# Altium schematic sheet COBConnector.SchDoc
size C; SheetNumber: 2; SheetTotal: 3
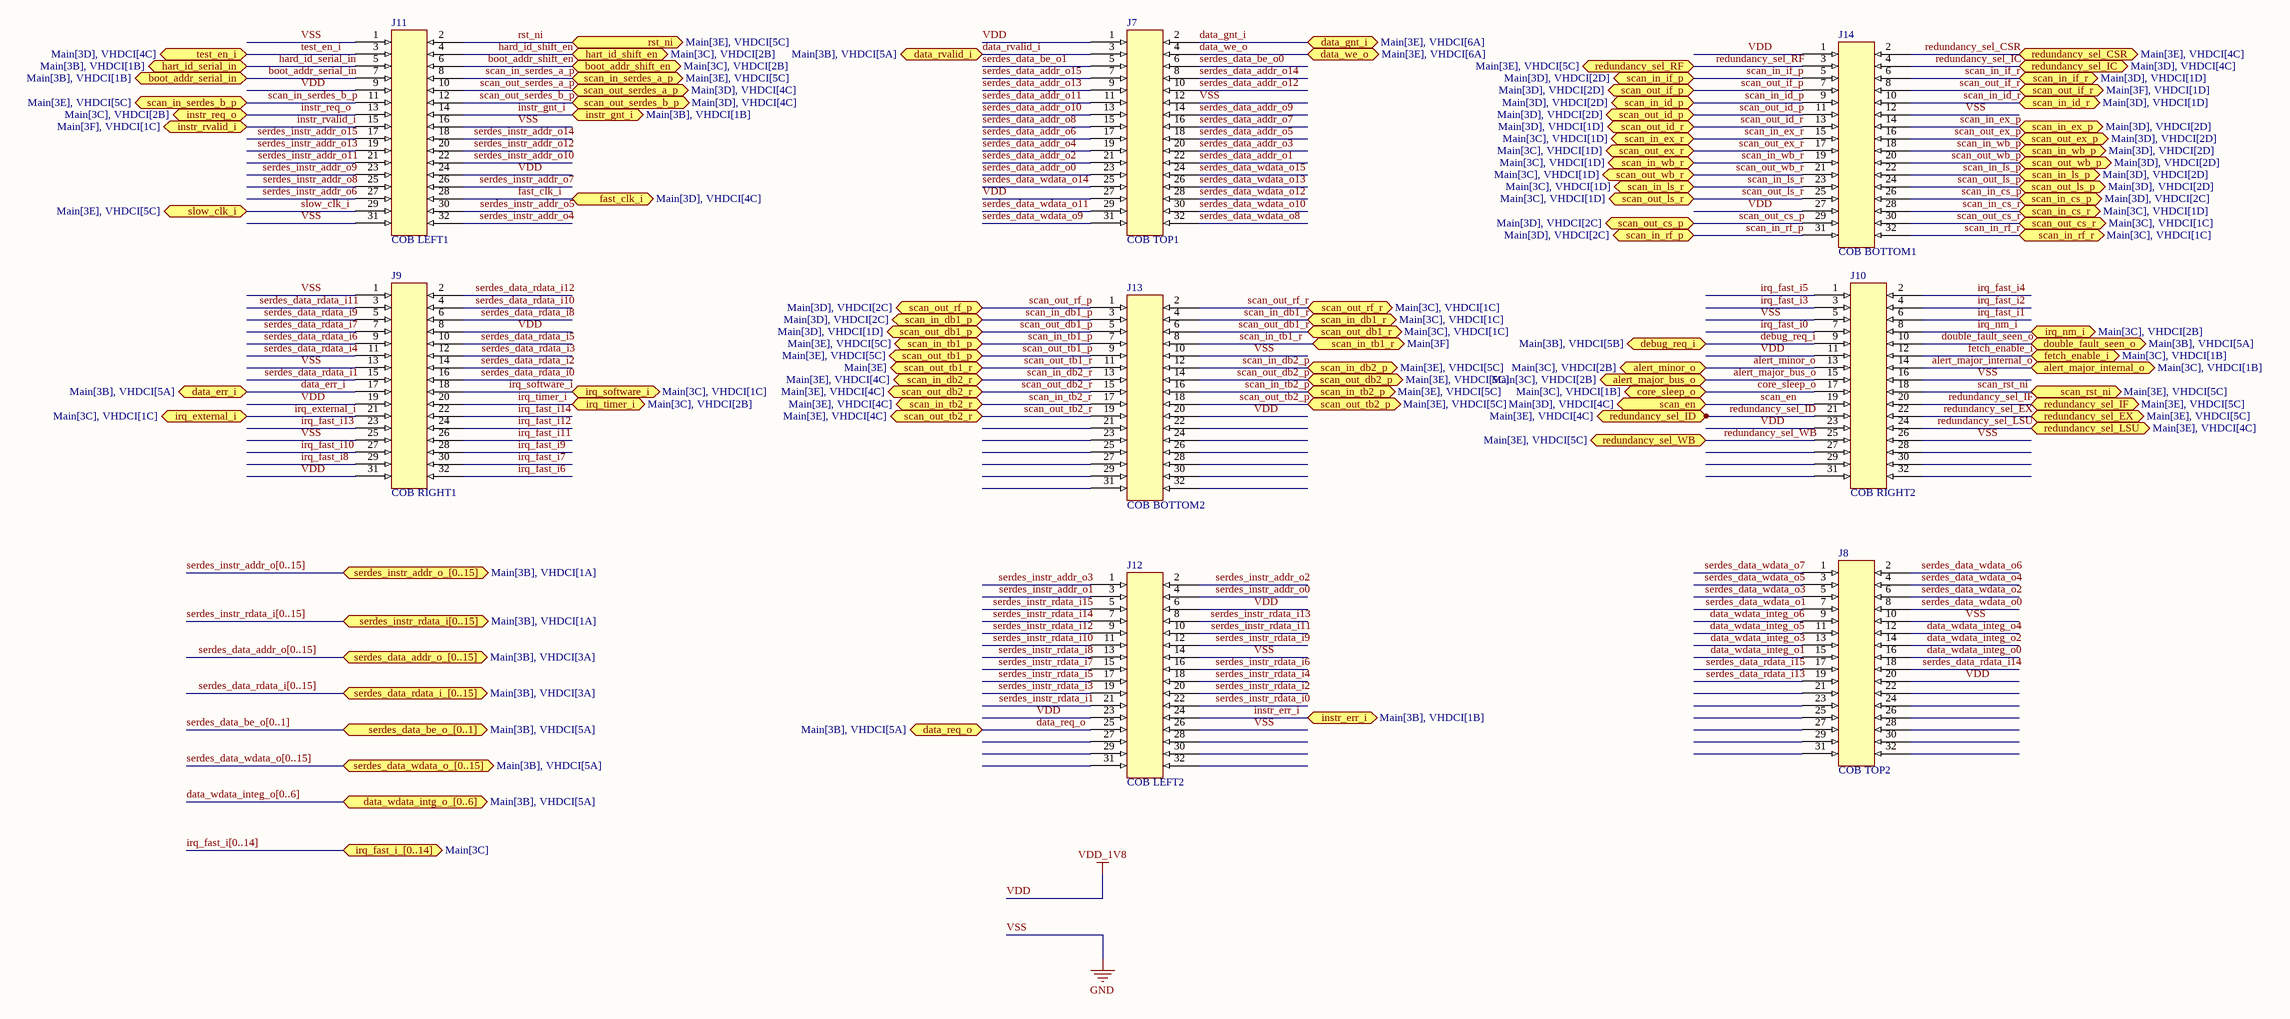
[diagram p0: COBConnector.SchDoc]

## Parts
J7  COB TOP1  [CON32_2X16_TU_BBS_SAI]
J8  COB TOP2  [CON32_2X16_TU_BBS_SAI]
J9  COB RIGHT1  [CON32_2X16_TU_BBS_SAI]
J10  COB RIGHT2  [CON32_2X16_TU_BBS_SAI]
J11  COB LEFT1  [CON32_2X16_TU_BBS_SAI]
J12  COB LEFT2  [CON32_2X16_TU_BBS_SAI]
J13  COB BOTTOM2  [CON32_2X16_TU_BBS_SAI]
J14  COB BOTTOM1  [CON32_2X16_TU_BBS_SAI]

## Ports
alert_major_bus_o (bidir, see Main[3C], VHDCI[2B]), alert_major_internal_o (bidir, see Main[3C], VHDCI[1B]), alert_minor_o (bidir, see Main[3C], VHDCI[2B]), boot_addr_serial_in (bidir, see Main[3B], VHDCI[1B]), boot_addr_shift_en (bidir, see Main[3C], VHDCI[2B]), core_sleep_o (bidir, see Main[3C], VHDCI[1B]), data_err_i (bidir, see Main[3B], VHDCI[5A]), data_gnt_i (bidir, see Main[3E], VHDCI[6A]), data_req_o (bidir, see Main[3B], VHDCI[5A]), data_rvalid_i (bidir, see Main[3B], VHDCI[5A]), data_wdata_intg_o_[0..6] (bidir, see Main[3B], VHDCI[5A]), data_we_o (bidir, see Main[3E], VHDCI[6A]), debug_req_i (bidir, see Main[3B], VHDCI[5B]), double_fault_seen_o (bidir, see Main[3B], VHDCI[5A]), fast_clk_i (bidir, see Main[3D], VHDCI[4C]), fetch_enable_i (bidir, see Main[3C], VHDCI[1B]), hart_id_serial_in (bidir, see Main[3B], VHDCI[1B]), hart_id_shift_en (bidir, see Main[3C], VHDCI[2B]), instr_err_i (bidir, see Main[3B], VHDCI[1B]), instr_gnt_i (bidir, see Main[3B], VHDCI[1B]), instr_req_o (bidir, see Main[3C], VHDCI[2B]), instr_rvalid_i (bidir, see Main[3F], VHDCI[1C]), irq_external_i (bidir, see Main[3C], VHDCI[1C]), irq_fast_i_[0..14] (bidir, see Main[3C]), irq_nm_i (bidir, see Main[3C], VHDCI[2B]), irq_software_i (bidir, see Main[3C], VHDCI[1C]), irq_timer_i (bidir, see Main[3C], VHDCI[2B]), redundancy_sel_CSR (bidir, see Main[3E], VHDCI[4C]), redundancy_sel_EX (bidir, see Main[3E], VHDCI[5C]), redundancy_sel_IC (bidir, see Main[3D], VHDCI[4C]), redundancy_sel_ID (bidir, see Main[3E], VHDCI[4C]), redundancy_sel_IF (bidir, see Main[3E], VHDCI[5C]), redundancy_sel_LSU (bidir, see Main[3E], VHDCI[4C]), redundancy_sel_RF (bidir, see Main[3E], VHDCI[5C]), redundancy_sel_WB (bidir, see Main[3E], VHDCI[5C]), rst_ni (bidir, see Main[3E], VHDCI[5C]), scan_en (bidir, see Main[3D], VHDCI[4C]), scan_in_cs_p (bidir, see Main[3D], VHDCI[2C]), scan_in_cs_r (bidir, see Main[3C], VHDCI[1D]), scan_in_db1_p (bidir, see Main[3D], VHDCI[2C]), scan_in_db1_r (bidir, see Main[3C], VHDCI[1C]), scan_in_db2_p (bidir, see Main[3E], VHDCI[5C]), scan_in_db2_r (bidir, see Main[3E], VHDCI[4C]), scan_in_ex_p (bidir, see Main[3D], VHDCI[2D]), scan_in_ex_r (bidir, see Main[3C], VHDCI[1D]), scan_in_id_p (bidir, see Main[3D], VHDCI[2D]), scan_in_id_r (bidir, see Main[3D], VHDCI[1D]), scan_in_if_p (bidir, see Main[3D], VHDCI[2D]), scan_in_if_r (bidir, see Main[3D], VHDCI[1D]), scan_in_ls_p (bidir, see Main[3D], VHDCI[2D]), scan_in_ls_r (bidir, see Main[3C], VHDCI[1D]), scan_in_rf_p (bidir, see Main[3D], VHDCI[2C]), scan_in_rf_r (bidir, see Main[3C], VHDCI[1C]), scan_in_serdes_a_p (bidir, see Main[3E], VHDCI[5C]), scan_in_serdes_b_p (bidir, see Main[3E], VHDCI[5C]), scan_in_tb1_p (bidir, see Main[3E], VHDCI[5C]), scan_in_tb1_r (bidir, see Main[3F]), scan_in_tb2_p (bidir, see Main[3E], VHDCI[5C]), scan_in_tb2_r (bidir, see Main[3E], VHDCI[4C]), scan_in_wb_p (bidir, see Main[3D], VHDCI[2D]), scan_in_wb_r (bidir, see Main[3C], VHDCI[1D]), scan_out_cs_p (bidir, see Main[3D], VHDCI[2C]), scan_out_cs_r (bidir, see Main[3C], VHDCI[1C]), scan_out_db1_p (bidir, see Main[3D], VHDCI[1D]), scan_out_db1_r (bidir, see Main[3C], VHDCI[1C]), scan_out_db2_p (bidir, see Main[3E], VHDCI[5C]), scan_out_db2_r (bidir, see Main[3E], VHDCI[4C]), scan_out_ex_p (bidir, see Main[3D], VHDCI[2D]), scan_out_ex_r (bidir, see Main[3C], VHDCI[1D]), scan_out_id_p (bidir, see Main[3D], VHDCI[2D]), scan_out_id_r (bidir, see Main[3D], VHDCI[1D]), scan_out_if_p (bidir, see Main[3D], VHDCI[2D]), scan_out_if_r (bidir, see Main[3F], VHDCI[1D]), scan_out_ls_p (bidir, see Main[3D], VHDCI[2D]), scan_out_ls_r (bidir, see Main[3C], VHDCI[1D]), scan_out_rf_p (bidir, see Main[3D], VHDCI[2C]), scan_out_rf_r (bidir, see Main[3C], VHDCI[1C]), scan_out_serdes_a_p (bidir, see Main[3D], VHDCI[4C]), scan_out_serdes_b_p (bidir, see Main[3D], VHDCI[4C]), scan_out_tb1_p (bidir, see Main[3E], VHDCI[5C]), scan_out_tb1_r (bidir, see Main[3E]), scan_out_tb2_p (bidir, see Main[3E], VHDCI[5C]), scan_out_tb2_r (bidir, see Main[3E], VHDCI[4C]), scan_out_wb_p (bidir, see Main[3D], VHDCI[2D]), scan_out_wb_r (bidir, see Main[3C], VHDCI[1D]), scan_rst_ni (bidir, see Main[3E], VHDCI[5C]), serdes_data_addr_o_[0..15] (bidir, see Main[3B], VHDCI[3A]), serdes_data_be_o_[0..1] (bidir, see Main[3B], VHDCI[5A]), serdes_data_rdata_i_[0..15] (bidir, see Main[3B], VHDCI[3A]), serdes_data_wdata_o_[0..15] (bidir, see Main[3B], VHDCI[5A]), serdes_instr_addr_o_[0..15] (bidir, see Main[3B], VHDCI[1A]), serdes_instr_rdata_i[0..15] (bidir, see Main[3B], VHDCI[1A]), slow_clk_i (bidir, see Main[3E], VHDCI[5C]), test_en_i (bidir, see Main[3D], VHDCI[4C])

## Nets
VDD: J7.1 J7.27 J8.20 J9.8 J9.19 J9.31 J10.11 J10.23 J11.9 J11.24 J12.6 J12.23 J13.20 J14.1 J14.27  [also labelled VDD_1V8]
VSS: J7.12 J8.10 J9.1 J9.13 J9.25 J10.5 J10.16 J10.26 J11.1 J11.16 J11.31 J12.14 J12.26 J13.10 J14.12  [also labelled GND]
alert_major_bus_o: J10.15 ; port alert_major_bus_o
alert_major_internal_o: J10.14 ; port alert_major_internal_o
alert_minor_o: J10.13 ; port alert_minor_o
boot_addr_serial_in: J11.7 ; port boot_addr_serial_in
boot_addr_shift_en: J11.6 ; port boot_addr_shift_en
core_sleep_o: J10.17 ; port core_sleep_o
data_err_i: J9.17 ; port data_err_i
data_gnt_i: J7.2 ; port data_gnt_i
data_req_o: J12.25 ; port data_req_o
data_rvalid_i: J7.3 ; port data_rvalid_i
data_wdata_integ_o0: J8.16
data_wdata_integ_o1: J8.15
data_wdata_integ_o2: J8.14
data_wdata_integ_o3: J8.13
data_wdata_integ_o4: J8.12
data_wdata_integ_o5: J8.11
data_wdata_integ_o6: J8.9
data_we_o: J7.4 ; port data_we_o
debug_req_i: J10.9 ; port debug_req_i
double_fault_seen_o: J10.10 ; port double_fault_seen_o
fast_clk_i: J11.28 ; port fast_clk_i
fetch_enable_i: J10.12 ; port fetch_enable_i
hard_id_serial_in: J11.5 ; port hart_id_serial_in
hard_id_shift_en: J11.4 ; port hart_id_shift_en
instr_err_i: J12.24 ; port instr_err_i
instr_gnt_i: J11.14 ; port instr_gnt_i
instr_req_o: J11.13 ; port instr_req_o
instr_rvalid_i: J11.15 ; port instr_rvalid_i
irq_external_i: J9.21 ; port irq_external_i
irq_fast_i0: J10.7
irq_fast_i1: J10.6
irq_fast_i2: J10.4
irq_fast_i3: J10.3
irq_fast_i4: J10.2
irq_fast_i5: J10.1
irq_fast_i6: J9.32
irq_fast_i7: J9.30
irq_fast_i8: J9.29
irq_fast_i9: J9.28
irq_fast_i10: J9.27
irq_fast_i11: J9.26
irq_fast_i12: J9.24
irq_fast_i13: J9.23
irq_fast_i14: J9.22
irq_nm_i: J10.8 ; port irq_nm_i
irq_software_i: J9.18 ; port irq_software_i
irq_timer_i: J9.20 ; port irq_timer_i
redundancy_sel_CSR: J14.2 ; port redundancy_sel_CSR
redundancy_sel_EX: J10.22 ; port redundancy_sel_EX
redundancy_sel_IC: J14.4 ; port redundancy_sel_IC
redundancy_sel_ID: J10.21 ; port redundancy_sel_ID
redundancy_sel_IF: J10.20 ; port redundancy_sel_IF
redundancy_sel_LSU: J10.24 ; port redundancy_sel_LSU
redundancy_sel_RF: J14.3 ; port redundancy_sel_RF
redundancy_sel_WB: J10.25 ; port redundancy_sel_WB
rst_ni: J11.2 ; port rst_ni
scan_en: J10.19 ; port scan_en
scan_in_cs_p: J14.26 ; port scan_in_cs_p
scan_in_cs_r: J14.28 ; port scan_in_cs_r
scan_in_db1_p: J13.3 ; port scan_in_db1_p
scan_in_db1_r: J13.4 ; port scan_in_db1_r
scan_in_db2_p: J13.12 ; port scan_in_db2_p
scan_in_db2_r: J13.13 ; port scan_in_db2_r
scan_in_ex_p: J14.14 ; port scan_in_ex_p
scan_in_ex_r: J14.15 ; port scan_in_ex_r
scan_in_id_p: J14.9 ; port scan_in_id_p
scan_in_id_r: J14.10 ; port scan_in_id_r
scan_in_if_p: J14.5 ; port scan_in_if_p
scan_in_if_r: J14.6 ; port scan_in_if_r
scan_in_ls_p: J14.22 ; port scan_in_ls_p
scan_in_ls_r: J14.23 ; port scan_in_ls_r
scan_in_rf_p: J14.31 ; port scan_in_rf_p
scan_in_rf_r: J14.32 ; port scan_in_rf_r
scan_in_serdes_a_p: J11.8 ; port scan_in_serdes_a_p
scan_in_serdes_b_p: J11.11 ; port scan_in_serdes_b_p
scan_in_tb1_p: J13.7 ; port scan_in_tb1_p
scan_in_tb1_r: J13.8 ; port scan_in_tb1_r
scan_in_tb2_p: J13.16 ; port scan_in_tb2_p
scan_in_tb2_r: J13.17 ; port scan_in_tb2_r
scan_in_wb_p: J14.18 ; port scan_in_wb_p
scan_in_wb_r: J14.19 ; port scan_in_wb_r
scan_out_cs_p: J14.29 ; port scan_out_cs_p
scan_out_cs_r: J14.30 ; port scan_out_cs_r
scan_out_db1_p: J13.5 ; port scan_out_db1_p
scan_out_db1_r: J13.6 ; port scan_out_db1_r
scan_out_db2_p: J13.14 ; port scan_out_db2_p
scan_out_db2_r: J13.15 ; port scan_out_db2_r
scan_out_ex_p: J14.16 ; port scan_out_ex_p
scan_out_ex_r: J14.17 ; port scan_out_ex_r
scan_out_id_p: J14.11 ; port scan_out_id_p
scan_out_id_r: J14.13 ; port scan_out_id_r
scan_out_if_p: J14.7 ; port scan_out_if_p
scan_out_if_r: J14.8 ; port scan_out_if_r
scan_out_ls_p: J14.24 ; port scan_out_ls_p
scan_out_ls_r: J14.25 ; port scan_out_ls_r
scan_out_rf_p: J13.1 ; port scan_out_rf_p
scan_out_rf_r: J13.2 ; port scan_out_rf_r
scan_out_serdes_a_p: J11.10 ; port scan_out_serdes_a_p
scan_out_serdes_b_p: J11.12 ; port scan_out_serdes_b_p
scan_out_tb1_p: J13.9 ; port scan_out_tb1_p
scan_out_tb1_r: J13.11 ; port scan_out_tb1_r
scan_out_tb2_p: J13.18 ; port scan_out_tb2_p
scan_out_tb2_r: J13.19 ; port scan_out_tb2_r
scan_out_wb_p: J14.20 ; port scan_out_wb_p
scan_out_wb_r: J14.21 ; port scan_out_wb_r
scan_rst_ni: J10.18 ; port scan_rst_ni
serdes_data_addr_o0: J7.23
serdes_data_addr_o1: J7.22
serdes_data_addr_o2: J7.21
serdes_data_addr_o3: J7.20
serdes_data_addr_o4: J7.19
serdes_data_addr_o5: J7.18
serdes_data_addr_o6: J7.17
serdes_data_addr_o7: J7.16
serdes_data_addr_o8: J7.15
serdes_data_addr_o9: J7.14
serdes_data_addr_o10: J7.13
serdes_data_addr_o11: J7.11
serdes_data_addr_o12: J7.10
serdes_data_addr_o13: J7.9
serdes_data_addr_o14: J7.8
serdes_data_addr_o15: J7.7
serdes_data_be_o0: J7.6
serdes_data_be_o1: J7.5
serdes_data_rdata_i0: J9.16
serdes_data_rdata_i1: J9.15
serdes_data_rdata_i2: J9.14
serdes_data_rdata_i3: J9.12
serdes_data_rdata_i4: J9.11
serdes_data_rdata_i5: J9.10
serdes_data_rdata_i6: J9.9
serdes_data_rdata_i7: J9.7
serdes_data_rdata_i8: J9.6
serdes_data_rdata_i9: J9.5
serdes_data_rdata_i10: J9.4
serdes_data_rdata_i11: J9.3
serdes_data_rdata_i12: J9.2
serdes_data_rdata_i13: J8.19
serdes_data_rdata_i14: J8.18
serdes_data_rdata_i15: J8.17
serdes_data_wdata_o0: J8.8
serdes_data_wdata_o1: J8.7
serdes_data_wdata_o2: J8.6
serdes_data_wdata_o3: J8.5
serdes_data_wdata_o4: J8.4
serdes_data_wdata_o5: J8.3
serdes_data_wdata_o6: J8.2
serdes_data_wdata_o7: J8.1
serdes_data_wdata_o8: J7.32
serdes_data_wdata_o9: J7.31
serdes_data_wdata_o10: J7.30
serdes_data_wdata_o11: J7.29
serdes_data_wdata_o12: J7.28
serdes_data_wdata_o13: J7.26
serdes_data_wdata_o14: J7.25
serdes_data_wdata_o15: J7.24
serdes_instr_addr_o0: J12.4
serdes_instr_addr_o1: J12.3
serdes_instr_addr_o2: J12.2
serdes_instr_addr_o3: J12.1
serdes_instr_addr_o4: J11.32
serdes_instr_addr_o5: J11.30
serdes_instr_addr_o6: J11.27
serdes_instr_addr_o7: J11.26
serdes_instr_addr_o8: J11.25
serdes_instr_addr_o9: J11.23
serdes_instr_addr_o10: J11.22
serdes_instr_addr_o11: J11.21
serdes_instr_addr_o12: J11.20
serdes_instr_addr_o13: J11.19
serdes_instr_addr_o14: J11.18
serdes_instr_addr_o15: J11.17
serdes_instr_rdata_i0: J12.22
serdes_instr_rdata_i1: J12.21
serdes_instr_rdata_i2: J12.20
serdes_instr_rdata_i3: J12.19
serdes_instr_rdata_i4: J12.18
serdes_instr_rdata_i5: J12.17
serdes_instr_rdata_i6: J12.16
serdes_instr_rdata_i7: J12.15
serdes_instr_rdata_i8: J12.13
serdes_instr_rdata_i9: J12.12
serdes_instr_rdata_i10: J12.11
serdes_instr_rdata_i11: J12.10
serdes_instr_rdata_i12: J12.9
serdes_instr_rdata_i13: J12.8
serdes_instr_rdata_i14: J12.7
serdes_instr_rdata_i15: J12.5
slow_clk_i: J11.29 ; port slow_clk_i
test_en_i: J11.3 ; port test_en_i

Not connected (* = marked no-connect by the designer): J8 21 22 23 24 25 26 27 28 29 30 31 32; J10 27 28 29 30 31 32; J12 27 28 29 30 31 32; J13 21 22 23 24 25 26 27 28 29 30 31 32

## Buses and harness runs
bus data_wdata_integ_o[0..6] = port data_wdata_intg_o_[0..6]
bus irq_fast_i[0..14] = port irq_fast_i_[0..14]
bus serdes_data_addr_o[0..15] = port serdes_data_addr_o_[0..15]
bus serdes_data_be_o[0..1] = port serdes_data_be_o_[0..1]
bus serdes_data_rdata_i[0..15] = port serdes_data_rdata_i_[0..15]
bus serdes_data_wdata_o[0..15] = port serdes_data_wdata_o_[0..15]
bus serdes_instr_addr_o[0..15] = port serdes_instr_addr_o_[0..15]
bus serdes_instr_rdata_i[0..15] = port serdes_instr_rdata_i[0..15]

## Library data of the parts
J7-J14 = BBD-116-G-A